# EAGLE design rf-power-detector (EAGLE 7.3.0)
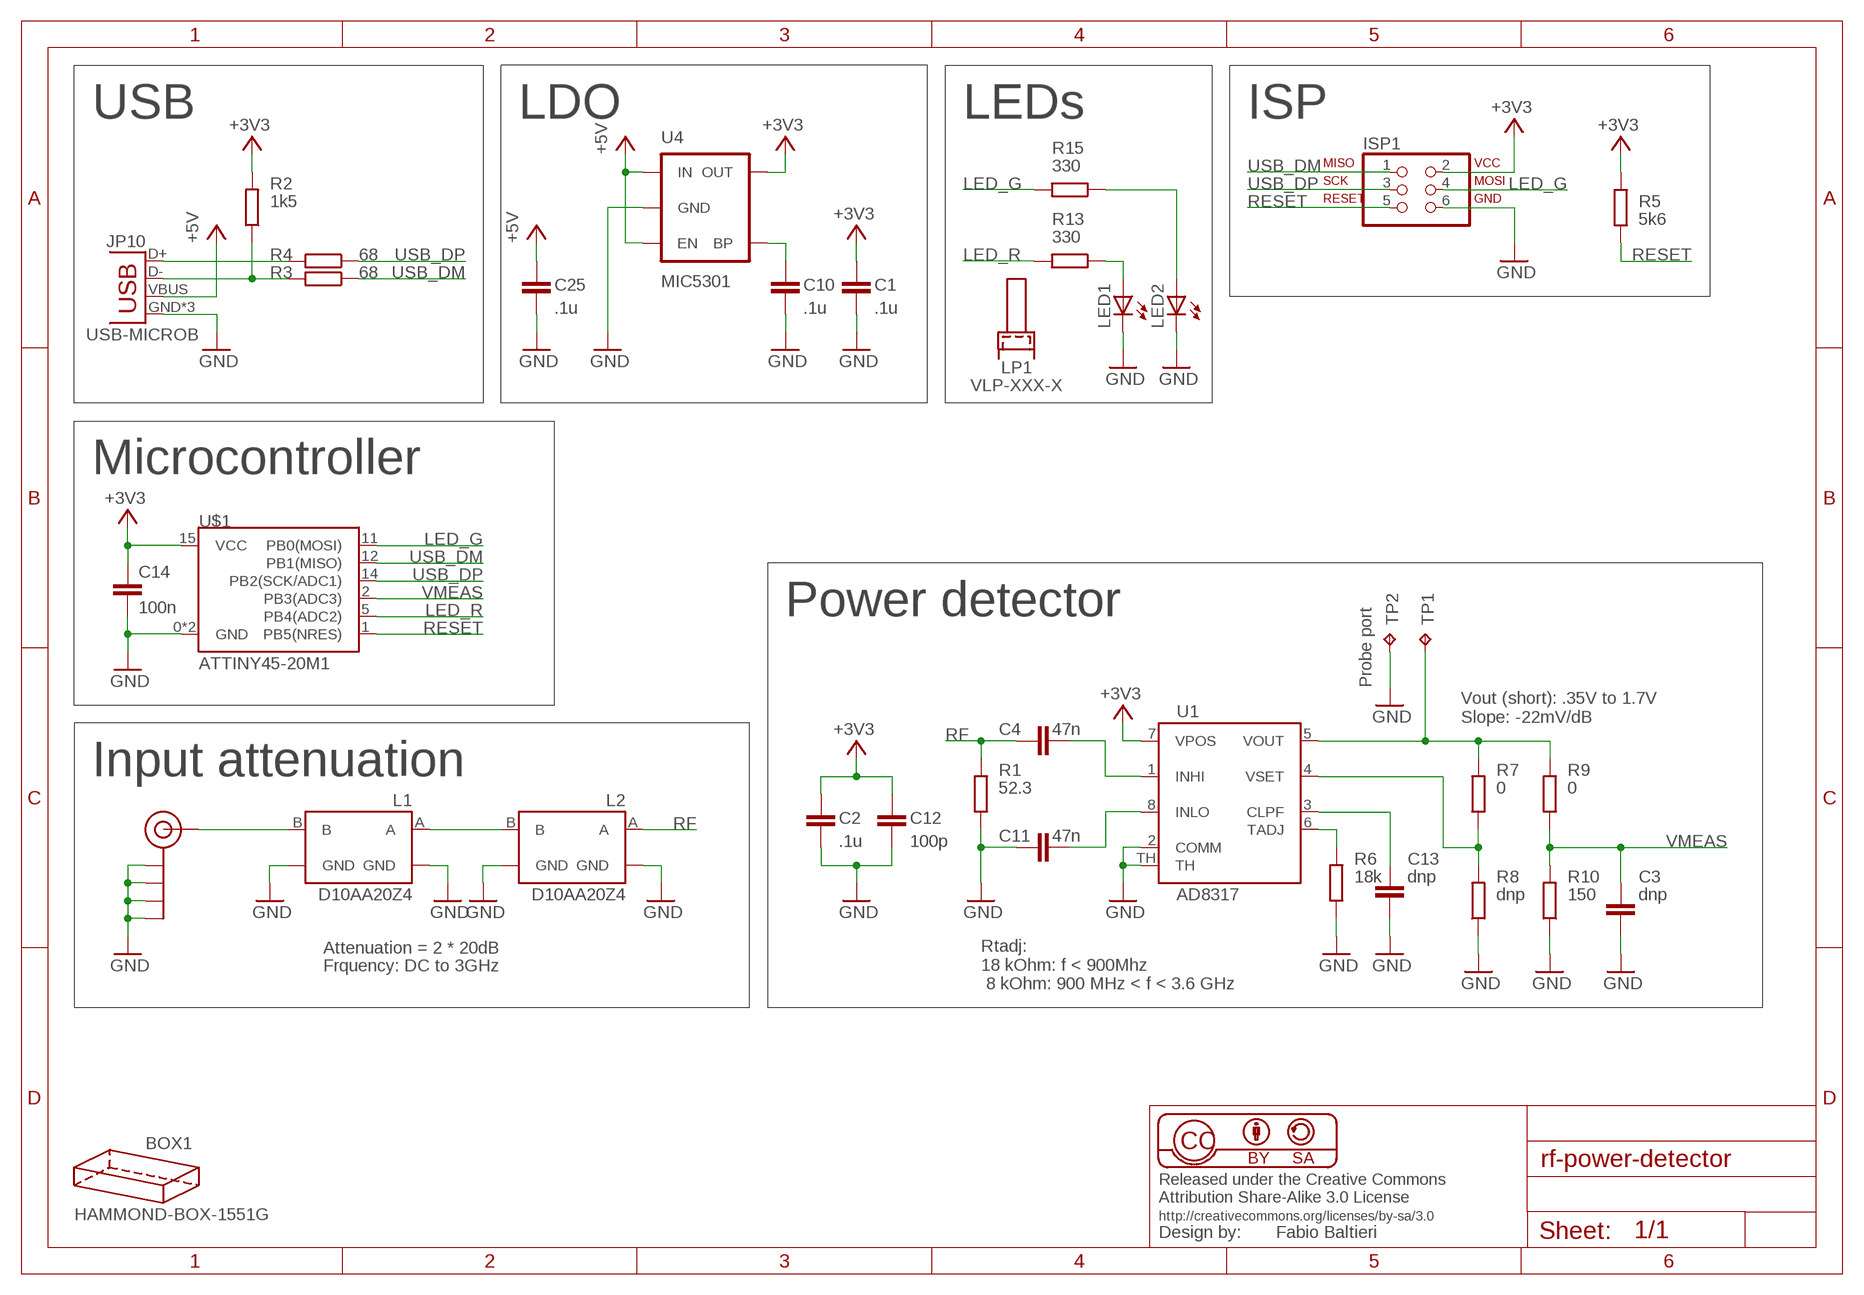
[diagram p0: schematic, sheet 1]

## Parts
BOX1  HAMMOND-BOX-1551G  [1551G]
C1  .1u  C-EUC0603  [C0603]
C2  .1u  C-EUC0603  [C0603]
C3  dnp  C-EUC0603  [C0603]
C4  47n  C-EUC0603  [C0603]
C10  .1u  C-EUC0603  [C0603]
C11  47n  C-EUC0603  [C0603]
C12  100p  C-EUC0603  [C0603]
C13  dnp  C-EUC0603  [C0603]
C14  100n  C-EUC0603  [C0603]
C25  .1u  C-EUC0603  [C0603]
ISP1  ISP-AVR910PTH  [2X03]
J$1  SMA_EDGE  [SMA-EDGE]
JP10  USB-MICROB  [USB-MICROB]
L1  D10AA20Z4  [D10AAXXZ4]
L2  D10AA20Z4  [D10AAXXZ4]
LED1  LEDSML0805  [SML0805]
LED2  LEDSML0805  [SML0805]
LP1  VLP-XXX-X  [VLP-XXX-X]
R1  52.3  R-EU_R0603  [R0603]
R2  1k5  R-EU_R0603  [R0603]
R3  68  R-EU_R0603  [R0603]
R4  68  R-EU_R0603  [R0603]
R5  5k6  R-EU_R0603  [R0603]
R6  18k  R-EU_R0603  [R0603]
R7  0  R-EU_R0603  [R0603]
R8  dnp  R-EU_R0603  [R0603]
R9  0  R-EU_R0603  [R0603]
R10  150  R-EU_R0603  [R0603]
R13  330  R-EU_R0603  [R0603]
R15  330  R-EU_R0603  [R0603]
TP1  TPPAD1-13  [P1-13]
TP2  TPPAD1-13  [P1-13]
U1  AD8317  [LFCSP8]
U4  MIC5301  V_REG_LDOSMD  [SOT23-5]
U$1  ATTINY45-20M1  [QFN20]

## Nets
+3V3: C1.1 C2.1 C12.1 C14.1 ISP1.2 R2.2 R5.1 U1.7(VPOS) U4.5(OUT) U$1.15(VCC)
+5V: C25.1 JP10.VBUS U4.1(IN) U4.3(EN)
GND: C1.2 C2.2 C3.2 C10.2 C11.1 C12.2 C13.2 C14.2 C25.2 ISP1.6 J$1.GND@0(GND) J$1.GND@1(GND) J$1.GND@2(GND) J$1.GND@3(GND) JP10.GND JP10.MT1(GND) JP10.MT2(GND) L1.GND@0(GND) L1.GND@1(GND) L2.GND@0(GND) L2.GND@1(GND) LED1.C LED2.C R1.1 R6.1 R8.1 R10.1 TP2.TP U1.2(COMM) U1.TH U4.2(GND) U$1.0(GND) U$1.8(GND)
LED_G: ISP1.4 R15.2 U$1.11(PB0(MOSI))
LED_R: R13.2 U$1.5(PB4(ADC2))
N$1: JP10.D+ R4.2
N$2 [rf]: J$1.SIG(SIGNAL) L1.B
N$3: LED1.A R13.1
N$4 [rf]: L1.A L2.B
N$5: C4.2 U1.1(INHI)
N$6: C11.2 U1.8(INLO)
N$7: JP10.D- R2.1 R3.2
N$8: C10.1 U4.4(BP)
N$10: R6.2 U1.6(TADJ)
N$11: C13.1 U1.3(CLPF)
N$12: R7.1 R8.2 U1.4(VSET)
N$13: R7.2 R9.2 TP1.TP U1.5(VOUT)
N$23: LED2.A R15.1
RESET: ISP1.5 R5.2 U$1.1(PB5(NRES))
RF [rf]: C4.1 L2.A R1.2
USB_DM: ISP1.1 R3.1 U$1.12(PB1(MISO))
USB_DP: ISP1.3 R4.1 U$1.14(PB2(SCK/ADC1))
VMEAS: C3.1 R9.1 R10.2 U$1.2(PB3(ADC3))

## Notes on the sheet
- USB | LDO | LEDs | ISP
- Microcontroller
- Power detector
- Probe port
- Vout (short): .35V to 1.7V
  Slope: -22mV/dB
- Input attenuation
- Attenuation = 2 * 20dB
- Frquency: DC to 3GHz
- Rtadj:
  18 kOhm: f < 900Mhz
   8 kOhm: 900 MHz < f < 3.6 GHz

## Library data of the parts
BOX1 = hammond:HAMMOND-BOX: Hammond Project boxes Hammond 1551 Transluscent Blue 50x35x20mm 1551GTBU http://www.hammondmfg.com/pdf/1551G.pdf Hammond 1551 Transluscent Blue 50x50x20mm 1551RTBU http://www.hammondmfg.com/pdf/1551R.pdf Hammond 1551 Transluscent Blue 60x35x20mm 1551HTBU http://www.hammondmfg.com/pdf/1551H.pdf Hammond 1551 Transluscent Blue 80x40x20mm 1551KTBU http://www.hammondmfg.com/pdf/1551K.pdf Hammond 1591 Transluscent Blue 100x51x22m m 1591XXATBU http://www.hammondmfg.com/pdf/1591XXA.pdf
C1-C4 C10-C14 C25 = rcl:C-EU: CAPACITOR, European symbol
ISP1 = balto:ISP-AVR910: PIN HEADER
J$1 = SparkFun-Connectors:SMA_EDGE: SMA Antenna Connector End launch SMA connector. The paste layer has been removed so that the connector can be hand soldered onto the board after reflow.
JP10 = SparkFun-Connectors:USB: USB Connectors USB-B-PTH is fully proven SKU : PRT-00139/CONN-08278 USB-miniB is fully proven SKU : PRT-00587 USB-A-PCB is untested. USB-A-H is throughly reviewed, but untested. Spark Fun Electronics SKU : PRT-00437 USB-B-SMT is throughly reviewed, but untested. Needs silkscreen touching up. USB-A-S has not been used/tested USB-MB-H has not been used/tested USB-MICROB has been used. CONN-09505; PROD_ID: CONN-09505
L1 L2 = balto:D10AA: Surface Mount Attenuator 10 Watts
LED1 LED2 = led:LED: LED OSRAM: - CHIPLED LG R971, LG N971, LY N971, LG Q971, LY Q971, LO R971, LY R971 LH N974, LH R974 LS Q976, LO Q976, LY Q976 LO Q996 - Hyper CHIPLED LW Q18S LB Q993, LB Q99A, LB R99A - SideLED LS A670, LO A670, LY A670, LG A670, LP A670 LB A673, LV A673, LT A673, LW A673 LH A674 LY A675 LS A676, LA A676, LO A676, LY A676, LW A676 LS A679, LY A679, LG A679 - Hyper Micro SIDELED® LS Y876, LA Y876, LO Y876, LY Y876 LT Y87S - SmartLED LW L88C, LW L88S LB L89C, LB L89S, LG L890 LS L89K, LO L89K, LY L89K LS L896, LA L896, LO L896, LY L896 - TOPLED LS T670, LO T670, LY T670, LG T670, LP T670 LSG T670, LSP T670, LSY T670, LOP T670, LYG T670 LG T671, LOG T671, LSG T671 LB T673, LV T673, LT T673, LW T673 LH T674 LS T676, LA T676, LO T676, LY T676, LB T676, LH T676, LSB T676, LW T676 LB T67C, LV T67C, LT T67C, LS T67K, LO T67K, LY T67K, LW E67C LS E67B, LA E67B, LO E67B, LY E67B, LB E67C, LV E67C, LT E67C LW T67C LS T679, LY T679, LG T679 LS T770, LO T770, LY T770, LG T770, LP T770 LB T773, LV T773, LT T773, LW T773 LH T774 LS E675, LA E675, LY E675, LS T675 LS T776, LA T776, LO T776, LY T776, LB T776 LHGB T686 LT T68C, LB T68C - Hyper Mini TOPLED® LB M676 - Mini TOPLED Santana® LG M470 LS M47K, LO M47K, LY M47K Source: http://www.osram.convergy.de LUXEON: - LUMILED® LXK2-PW12-R00, LXK2-PW12-S00, LXK2-PW14-U00, LXK2-PW14-V00 LXK2-PM12-R00, LXK2-PM12-S00, LXK2-PM14-U00 LXK2-PE12-Q00, LXK2-PE12-R00, LXK2-PE12-S00, LXK2-PE14-T00, LXK2-PE14-U00 LXK2-PB12-K00, LXK2-PB12-L00, LXK2-PB12-M00, LXK2-PB14-N00, LXK2-PB14-P00, LXK2-PB14-Q00 LXK2-PR12-L00, LXK2-PR12-M00, LXK2-PR14-Q00, LXK2-PR14-R00 LXK2-PD12-Q00, LXK2-PD12-R00, LXK2-PD12-S00 LXK2-PH12-R00, LXK2-PH12-S00 LXK2-PL12-P00, LXK2-PL12-Q00, LXK2-PL12-R00 Source: www.luxeon.com KINGBRIGHT: KA-3528ASYC Source: www.kingbright.com
LP1 = balto:VLP-XXX-X: Bivar Light Pipe
R1-R10 R13 R15 = rcl:R-EU_: RESISTOR, European symbol
TP1 TP2 = testpad:TP: Test pad
U1 = balto:AD8317: 1 MHz to 10 GHz, 55 dB Log Detector/Controller
U4 = SparkFun-PowerIC:V_REG_LDO: Voltage Regulator LDO Standard 150mA LDO voltage regulator in SOT-23 layout. Micrel part MIC5205. BP (by-pass) pin is used to lower output noise with 470pF cap.
U$1 = balto:ATTINY45: Atmel 8-pin 2/4/8kB flash uC

## Net classes
0 default: clearance 0.152 mm
1 rf: clearance 0.864 mm

## Board
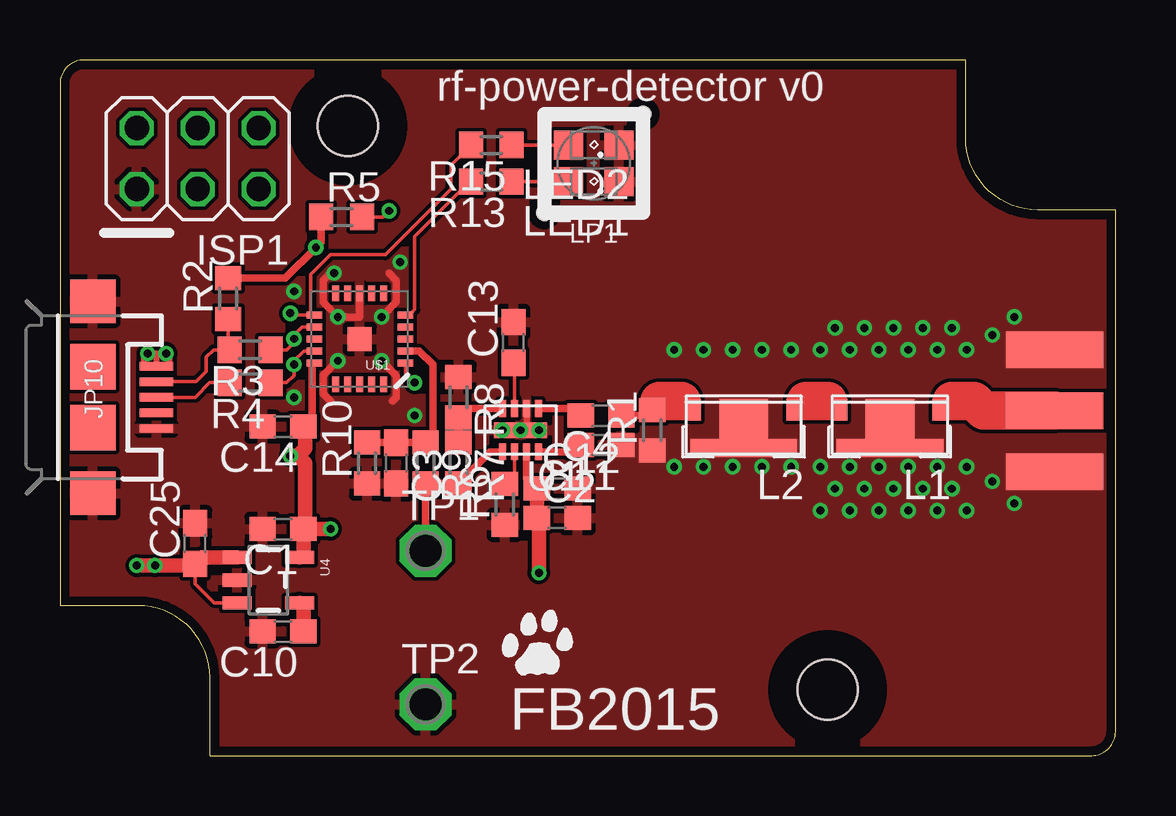
[diagram p1: board, top side]
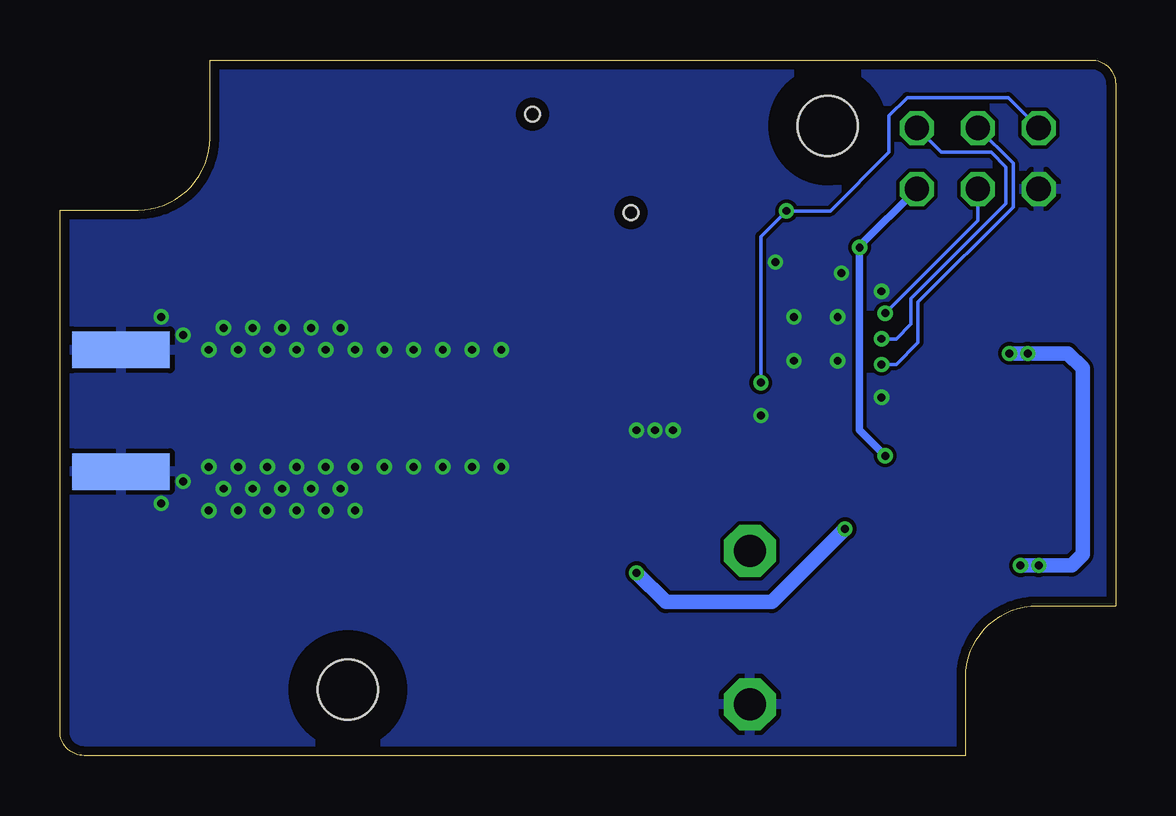
[diagram p2: board, bottom side, seen from below]

Size 44 x 29 mm. Coordinates in mm from the lower left corner, seen from the top.
Copper layers (1*16): Top 0.035mm / dielectric 1.5mm / Bottom 0.035mm
Design rules "balto": minimum track width 6mil, minimum drill 13mil, track to track 6mil, track to pad 6mil, pad to pad 6mil, via to via 6mil, smd to smd 6mil, copper to edge 15mil, drill to drill 6mil, minimum pad ring 6mil, minimum via ring 6mil, stop-mask expansion 2mil, vias tented up to drill 20mil, thermal gap 8mil

### Footprints (pad centres in the part's own frame; a part is rotated, then mirrored left to right if it is on the bottom)
1551G = hole 2.5: 32,2.75; 12,26.25
C0603 = smd 1.1 x 1: 1 -0.85,0; 2 0.85,0
2X03 = drill 1.016 octagon: 1 -2.54,-1.27; 2 -2.54,1.27; 3 0,-1.27; 4 0,1.27; 5 2.54,-1.27; 6 2.54,1.27
SMA-EDGE = smd 1.524 x 4.064: GND@0 0,0; GND@1 5.08,0; SIG 2.54,0 | smd 1.524 x 4.064 bottom: GND@2 0,0; GND@3 5.08,0
USB-MICROB = smd 0.35 x 1.4: D+ 0,2.65; D- -0.65,2.65; GND 1.3,2.65; ID 0.65,2.65; VBUS -1.3,2.65 | smd 1.8 x 1.9: MT1 -4,0; MT2 4,0 | smd 1.9 x 1.9: P$1 -1.27,0; P$2 1.27,0
D10AAXXZ4 = smd 0.889 x 0.66: A 0.699,2.108; B 0.699,-2.108 | smd 0.762 x 4.445: GND@0 -0.889,0 | smd 2.286 x 2.032: GND@1 0,0
SML0805 = smd 1.2 x 1.2: A 1.05,0; C -1.05,0
VLP-XXX-X = hole 0.6: -2.05,-2.05; 2.05,2.05
R0603 = smd 1 x 1.1: 1 -0.85,0; 2 0.85,0
P1-13 = drill 1.321 pad 2.159 octagon: TP 0,0
LFCSP8 = smd 0.3 x 0.7: 1 -0.75,-0.9; 2 -0.25,-0.9; 3 0.25,-0.9; 4 0.75,-0.9; 5 0.75,0.9; 6 0.25,0.9; 7 -0.25,0.9; 8 -0.75,0.9 | smd 2.2 x 0.65: TH 0,0
SOT23-5 = smd 0.55 x 1.2: 1 -0.95,-1.3; 2 0,-1.3; 3 0.95,-1.3; 4 0.95,1.3; 5 -0.95,1.3
QFN20 = smd 1 x 1: 0 0,0 | smd 0.65 x 0.29: 1 -1.9,1; 2 -1.9,0.5; 3 -1.9,0; 4 -1.9,-0.5; 5 -1.9,-1; 11 1.9,-1; 12 1.9,-0.5; 13 1.9,0; 14 1.9,0.5; 15 1.9,1 | smd 0.29 x 0.65: 6 -1,-1.9; 7 -0.5,-1.9; 8 0,-1.9; 9 0.5,-1.9; 10 1,-1.9; 16 1,1.9; 17 0.5,1.9; 18 0,1.9; 19 -0.5,1.9; 20 -1,1.9

### Placement (x,y rotation side)
BOX1  0,0 0 top
C1  9.3,9.45 180 top
C2  20.73,9.91 0 top
C3  14.02,12.19 270 top
C4  22.56,14.17 180 top
C10  9.3,5.18 180 top
C11  22.56,12.95 180 top
C12  20.73,11.13 0 top
C13  18.9,17.22 90 top
C14  9.3,13.72 180 top
C25  5.64,8.84 90 top
ISP1  5.74,24.89 180 top
J$1  41.45,16.92 270 top
JP10  1.37,14.94 270 top
L1  34.59,13.72 90 top
L2  28.5,13.72 90 top
LED1  22.25,23.93 180 top
LED2  22.25,25.45 180 top
LP1  22.25,24.69 180 top
R1  24.69,13.56 90 top
R2  7.01,19.05 90 top
R3  7.92,16.92 180 top
R4  7.92,15.54 180 top
R5  11.73,22.45 0 top
R6  18.54,10.46 90 top
R7  16.61,12.19 270 top
R8  16.61,14.94 270 top
R9  15.24,12.19 270 top
R10  12.8,12.19 90 top
R13  17.98,23.93 180 top
R15  17.98,25.45 180 top
TP1  15.24,8.53 0 top
TP2  15.24,2.13 0 top
U1  19.2,13.56 180 top
U4  8.69,7.32 270 top
U$1  12.5,17.37 180 top
U$2  [CAT-L]  19.96,4.27 0 top

### Tracks (layer width: path | path; a pad name or v marks a point on that pad's centre or on a via)
+3V3  (via drill 0.33)
  Top 0.305: U1.7 19.45,11.55 C12.1 | R5.1 10.88,21.4 v10.67,21.18 9.38,19.9 R2.2 | U$1.15 10.52,16.29 10.52,14.09 C14.1
  Top 0.61: U4.5 10.15,8.43 C1.1 | C1.1 v11.28,9.45 | 19.81,9.84 C2.1 | C2.1 C12.1 | 9.91,12.5 10.21,12.19 10.21,9.51 C1.1 | 9.91,12.5 10.21,12.8 10.21,13.65 C14.1 | v9.6,12.5 9.91,12.5 | v19.96,7.62 19.96,9.82 C2.1
  Bottom 0.305: v9.6,12.5 10.67,13.56 v10.67,21.18 10.67,21.23 ISP1.2
  Bottom 0.61: v11.28,9.45 14.33,6.4 18.75,6.4 v19.96,7.62
+5V  (via drill 0.33)
  Top 0.152: C25.1 5.64,7.16 6.44,6.37 U4.3
  Top 0.254: JP10.VBUS 3.5,16.23 3.5,16.76 v3.66,16.76 4.02,16.76 | JP10.VBUS 4.57,16.23 4.57,16.76 v4.42,16.76 4.02,16.76 | JP10.VBUS 4.02,16.76
  Top 0.61: v3.2,7.92 v3.96,7.92 5.57,7.92 C25.1 5.92,8.27 U4.1
  Bottom 0.61: v4.42,16.76 v3.66,16.76 1.98,16.76 1.37,16.15 1.37,8.38 1.83,7.92 v3.2,7.92 v3.96,7.92
GND  (via drill 0.33)
  Top 0.254: U1.2 19.45,13.56 U1.TH
  Top 0.305: U$1.8 12.5,18.29 v11.58,18.29 | v11.58,16.46 10.97,15.85 10.97,15.09 11.28,14.78 | v13.41,18.29 14.02,18.9 14.02,19.81 13.72,20.12 | v13.41,16.46 14.02,15.85 14.02,14.94 13.87,14.78 | 11.28,18.59 10.97,18.9 10.97,19.81 11.28,20.12
  other vias: 19.2,13.56 18.44,13.56 19.96,13.56 11.43,20.12 14.78,14.17 14.17,20.57 9.75,14.94 9.75,19.35 36.58,12.04 35.36,12.04 34.14,12.04 32.92,12.04 31.7,12.04 30.48,12.04 29.26,12.04 28.04,12.04 26.82,12.04 25.6,12.04 37.8,12.04 38.86,11.43 39.78,10.52 33.53,11.13 34.75,11.13 35.97,11.13 32.92,10.21 34.14,10.21 35.36,10.21 36.58,10.21 32.31,11.13 37.19,11.13 36.58,16.92 35.36,16.92 34.14,16.92 32.92,16.92 31.7,16.92 30.48,16.92 29.26,16.92 28.04,16.92 26.82,16.92 25.6,16.92 37.8,16.92 38.86,17.53 39.78,18.29 31.7,10.21 37.8,10.21 32.31,17.83 33.53,17.83 34.75,17.83 35.97,17.83 37.19,17.83
  pour Bottom (isolate 0.152): -0.3,-0.3 44.35,-0.3 44.35,29.41 -0.3,29.41
  pour Top (isolate 0.152): 44.81,-0.91 -0.76,-0.76 -0.76,29.87 44.81,29.72
  pour Top (isolate 0.254, no thermals): 23.16,18.14 43.43,18.14 43.43,10.67 23.16,10.67
LED_G  (via drill 0.33)
  Top 0.152: R15.2 16.31,24.62 16.31,23.62 13.56,20.88 11.28,20.88 10.44,20.05 10.44,18.37 U$1.11 9.67,18.37 v9.6,18.44
  Bottom 0.152: ISP1.4 5.74,22.3 v9.6,18.44
LED_R
  Top 0.152: U$1.5 14.56,18.37 14.78,18.59 14.78,21.64 17.07,23.93 R13.2
N$1
  Top 0.152: R4.2 6.25,15.54 5.64,14.94 JP10.D+
N$2
  Top 0.406: L1.B 36.82,14.41 37.19,14.78
  Top 1.6: 37.19,14.78 38.1,14.78 38.51,14.38 J$1.SIG
N$3
  Top 0.152: R13.1 LED1.A
N$4
  Top 0.406: L2.B 30.72,14.41 31.09,14.78 | L1.A 32.37,14.41 32,14.78
  Top 1.6: 31.09,14.78 32,14.78
N$5
  Top 0.305: U1.1 21.41,14.46 C4.2
N$6
  Top 0.305: U1.8 21.41,12.66 C11.2
N$7
  Top 0.152: R2.1 7.01,16.98 R3.2 6.4,16.92 6.1,16.61 6.1,16 5.68,15.59 JP10.D-
N$8
  Top 0.61: C10.1 10.15,6.21 U4.4
N$10
  Top 0.152: U1.6 18.95,11.72 R6.2
N$11
  Top 0.152: U1.3 18.95,16.32 C13.1
N$12
  Top 0.305: R7.1 R8.2 16.99,14.46 U1.4
N$13
  Top 0.305: U1.5 17.93,12.66 R7.2 R9.2 TP1.TP
N$23
  Top 0.152: R15.1 LED2.A
RESET  (via drill 0.33)
  Top 0.152: U$1.1 14.4,15.92 v14.77,15.54 v14.78,15.54 | v13.72,22.71 13.46,22.45 R5.2
  Bottom 0.152: ISP1.5 4.47,27.43 8.69,27.43 9.45,26.67 9.45,25.15 11.89,22.71 v13.72,22.71 14.78,21.64 v14.78,15.54
RF
  Top 0.305: L2.A 26.02,14.78 25.91,14.78 | C4.1 24.45,14.17 R1.2
  Top 0.406: R1.2 24.69,14.48 24.99,14.78
  Top 1.6: 25.91,14.78 24.99,14.78
USB_DM  (via drill 0.33)
  Top 0.152: U$1.12 10.1,17.87 9.75,17.53 v9.75,17.37 9.75,17.22 9.45,16.92 R3.1
  Bottom 0.152: ISP1.1 7.26,25.15 5.18,25.15 4.57,24.54 4.57,23.01 8.53,19.05 8.53,17.98 9.14,17.37 v9.75,17.37
USB_DP  (via drill 0.33)
  Top 0.152: R4.1 9.45,15.54 9.75,15.85 v9.75,16.31 9.75,16.46 10.17,16.87 U$1.14
  Bottom 0.152: ISP1.3 4.27,24.69 4.27,22.86 8.23,18.9 8.23,17.22 9.14,16.31 v9.75,16.31
VMEAS
  Top 0.305: R10.2 C3.1 R9.1 15.54,13.35 15.54,16.31 14.98,16.87 U$1.2

### Text on the board
_tsilk: rf-power-detector v0 | FB2015